# EAGLE design UCS (EAGLE 9.6.2)
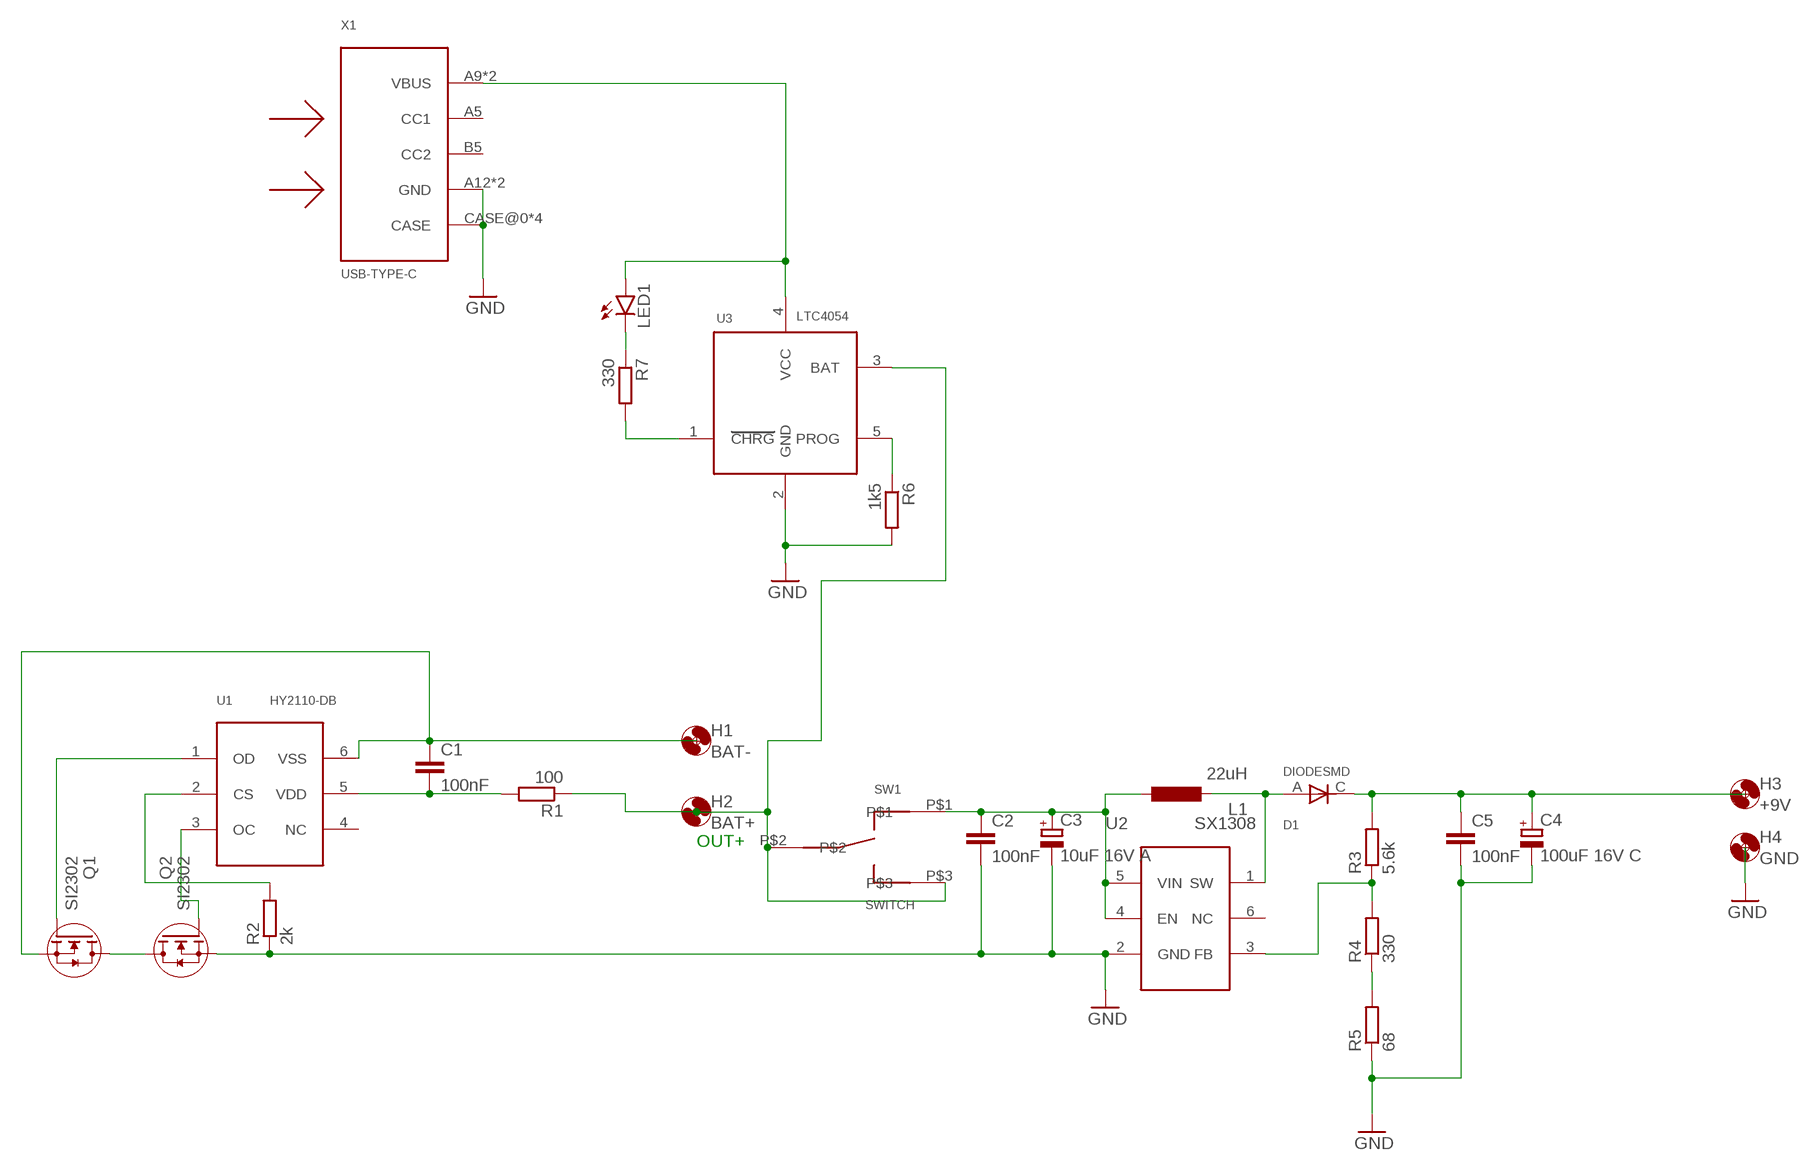
[diagram p0: schematic, sheet 1]

## Parts
C1  100nF  C-EUC0805  [C0805]
C2  100nF  C-EUC0805  [C0805]
C3  10uF 16V A  CPOL-EUSMCA  [SMC_A]
C4  100uF 16V C  CPOL-EUSMCC  [SMC_C]
C5  100nF  C-EUC0805  [C0805]
D1  DIODESMD  [DO214AC]
H1  BAT-  MOUNT-HOLE3.0  [3,0]
H2  BAT+  MOUNT-HOLE3.0  [3,0]
H3  +9V  MOUNT-HOLE3.0  [3,0]
H4  GND  MOUNT-HOLE3.0  [3,0]
L1  22uH  L-SMD-7*7*5  [L7*7*5]
LED1  LEDCHIPLED_0603  [CHIPLED_0603]
Q1  SI2302  [SOT-23-GSD]
Q2  SI2302  [SOT-23-GSD]
R1  100  R-EU_R0805  [R0805]
R2  2k  R-EU_R0805  [R0805]
R3  5.6k  R-EU_R0805  [R0805]
R4  330  R-EU_R0805  [R0805]
R5  68  R-EU_R0805  [R0805]
R6  1k5  R-EU_R0805  [R0805]
R7  330  R-EU_R0805  [R0805]
SW1  SWITCH  [SWITCH]
U1  HY2110-DB  [SOT-23-6]
U2  SX1308  [SOT-23-6]
U3  LTC4054  [SOT-23-5]
X1  USB-TYPE-C  [USB-TYPE-C]

## Nets
GND: C2.2 C3.- C4.- C5.2 H4.P$1 Q2.S R2.1 R5.1 R6.2 U2.2(GND) U3.2(GND) X1.A12(GND) X1.B12(GND) X1.CASE@0(CASE) X1.CASE@1(CASE) X1.CASE@2(CASE) X1.CASE@3(CASE)
N$1: H2.P$1 R1.1 SW1.P$2 SW1.P$3 U3.3(BAT)
N$2: C1.2 R1.2 U1.5(VDD)
N$3: C1.1 H1.P$1 Q1.S U1.6(VSS)
N$4: Q1.D Q2.D
N$5: D1.A(ANOD) L1.P$2 U2.1(SW)
N$6: Q1.G U1.1(OD)
N$7: Q2.G U1.3(OC)
N$8: R2.2 U1.2(CS)
N$9: C4.+ C5.1 D1.C(KATOD) H3.P$1 R3.2
N$10: R3.1 R4.2 U2.3(FB)
N$11: R4.1 R5.2
N$12: LED1.A U3.4(VCC) X1.A9(VBUS) X1.B9(VBUS)
N$13: LED1.C R7.1
N$14: R7.2 U3.1(CHRG)
N$15: R6.1 U3.5(PROG)
N$16: C2.1 C3.+ L1.P$1 SW1.P$1 U2.4(EN) U2.5(VIN)
Unconnected: U1.4(NC) U2.6(NC) X1.A5(CC1) X1.B5(CC2)

## Notes on the sheet
- OUT+

## Library data of the parts
C1 C2 C5 = rcl:C-EU: CAPACITOR, European symbol; SPICEPREFIX: C
C3 C4 = rcl:CPOL-EU: POLARIZED CAPACITOR, European symbol; SPICEPREFIX: C
D1 = usb:DIODE: DIODE
H1-H4 = usb:MOUNT-HOLE: MOUNTING HOLE with drill center marker
L1 = usb:L-SMD
LED1 = led:LED: LED OSRAM: - CHIPLED LG R971, LG N971, LY N971, LG Q971, LY Q971, LO R971, LY R971 LH N974, LH R974 LS Q976, LO Q976, LY Q976 LO Q996 - Hyper CHIPLED LW Q18S LB Q993, LB Q99A, LB R99A - SideLED LS A670, LO A670, LY A670, LG A670, LP A670 LB A673, LV A673, LT A673, LW A673 LH A674 LY A675 LS A676, LA A676, LO A676, LY A676, LW A676 LS A679, LY A679, LG A679 - Hyper Micro SIDELED® LS Y876, LA Y876, LO Y876, LY Y876 LT Y87S - SmartLED LW L88C, LW L88S LB L89C, LB L89S, LG L890 LS L89K, LO L89K, LY L89K LS L896, LA L896, LO L896, LY L896 - TOPLED LS T670, LO T670, LY T670, LG T670, LP T670 LSG T670, LSP T670, LSY T670, LOP T670, LYG T670 LG T671, LOG T671, LSG T671 LB T673, LV T673, LT T673, LW T673 LH T674 LS T676, LA T676, LO T676, LY T676, LB T676, LH T676, LSB T676, LW T676 LB T67C, LV T67C, LT T67C, LS T67K, LO T67K, LY T67K, LW E67C LS E67B, LA E67B, LO E67B, LY E67B, LB E67C, LV E67C, LT E67C LW T67C LS T679, LY T679, LG T679 LS T770, LO T770, LY T770, LG T770, LP T770 LB T773, LV T773, LT T773, LW T773 LH T774 LS E675, LA E675, LY E675, LS T675 LS T776, LA T776, LO T776, LY T776, LB T776 LHGB T686 LT T68C, LB T68C - Hyper Mini TOPLED® LB M676 - Mini TOPLED Santana® LG M470 LS M47K, LO M47K, LY M47K Source: http://www.osram.convergy.de LUXEON: - LUMILED® LXK2-PW12-R00, LXK2-PW12-S00, LXK2-PW14-U00, LXK2-PW14-V00 LXK2-PM12-R00, LXK2-PM12-S00, LXK2-PM14-U00 LXK2-PE12-Q00, LXK2-PE12-R00, LXK2-PE12-S00, LXK2-PE14-T00, LXK2-PE14-U00 LXK2-PB12-K00, LXK2-PB12-L00, LXK2-PB12-M00, LXK2-PB14-N00, LXK2-PB14-P00, LXK2-PB14-Q00 LXK2-PR12-L00, LXK2-PR12-M00, LXK2-PR14-Q00, LXK2-PR14-R00 LXK2-PD12-Q00, LXK2-PD12-R00, LXK2-PD12-S00 LXK2-PH12-R00, LXK2-PH12-S00 LXK2-PL12-P00, LXK2-PL12-Q00, LXK2-PL12-R00 Source: www.luxeon.com KINGBRIGHT: KA-3528ASYC Source: www.kingbright.com
Q1 Q2 = usb:SI2302: N-канальный полевик
R1-R7 = rcl:R-EU_: RESISTOR, European symbol; SPICEPREFIX: R
SW1 = usb:SWITCH
U1 = usb:HY2110-DB
U2 = usb:SX1308
U3 = usb:LTC4054
X1 = usb:USB-TYPE-C

## Board
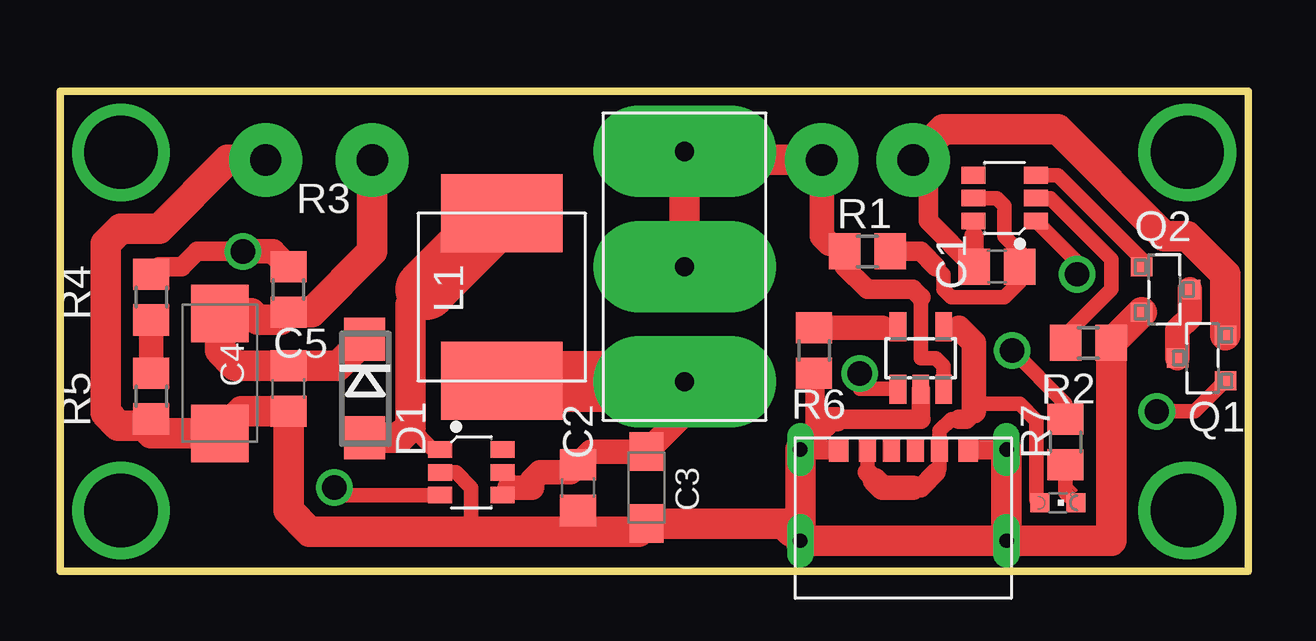
[diagram p1: board, top side]
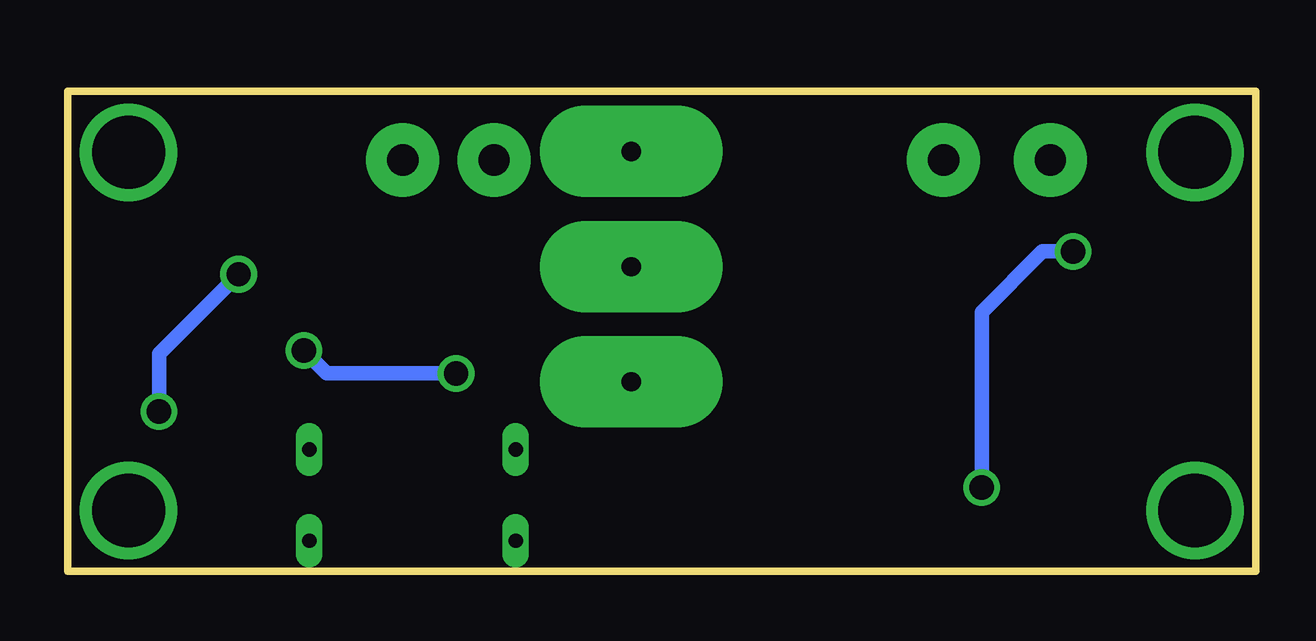
[diagram p2: board, bottom side, seen from below]

Size 49.53 x 20 mm. Coordinates in mm from the lower left corner, seen from the top.
Outline: 0,0 0,20 49.53,20 49.53,0 0,0
Copper layers (1*16): Top 0.035mm / dielectric 1.5mm / Bottom 0.035mm
Design rules "default": minimum track width 6mil, minimum drill 0.35mm, track to track 6mil, track to pad 6mil, pad to pad 6mil, via to via 6mil, smd to smd 6mil, copper to edge 40mil, drill to drill 6mil, minimum pad ring 10mil, minimum via ring 8mil, stop-mask expansion 4mil, vias tented up to drill 0mil, thermal gap 10mil

### Footprints (pad centres in the part's own frame; a part is rotated, then mirrored left to right if it is on the bottom)
C0805 = smd 1.3 x 1.5: 1 -0.95,0; 2 0.95,0
SMC_A = smd 1.6 x 1.4: + -1.5,0; - 1.5,0
SMC_C = smd 2.4 x 2.4: + -2.5,0; - 2.5,0
DO214AC = smd 1.8 x 1.7: A 2.05,0; C -2.05,0
3,0 = drill 1.3 pad 3.048: P$1 0,0
L7*7*5 = smd 3.251 x 5.08: P$1 -3.493,0; P$2 3.493,0
CHIPLED_0603 = smd 0.8 x 0.8: A 0,-0.75; C 0,0.75
SOT-23-GSD = smd 0.8 x 0.9: D 0,2; G -0.95,0; S 0.95,0
R0805 = smd 1.3 x 1.5: 1 -0.95,0; 2 0.95,0
SWITCH = drill 0.8 pad 3.81 long: P$1 -4.8,0; P$2 0,0; P$3 4.8,0
SOT-23-6 = smd 0.69 x 1: 1 -0.95,-1.3; 2 0,-1.3; 3 0.95,-1.3; 4 0.95,1.3; 5 0,1.3; 6 -0.95,1.3
SOT-23-5 = smd 0.69 x 1.2: 1 -0.95,-1.3; 2 0,-1.3; 3 0.95,-1.3; 4 0.95,1.3; 5 -0.95,1.3
USB-TYPE-C = smd 0.7 x 1: A5 1,0; A9 3,0; B5 2,0; B9 0,0 | smd 0.8 x 1: A12 4.2,0; B12 -1.2,0 | drill 0.6 pad 1.016 long: CASE@0 -2.8,0; CASE@1 -2.8,-3.8; CASE@2 5.8,-3.8; CASE@3 5.8,0

### Placement (x,y rotation side)
C1  39.05,12.7 0 top
C2  21.59,3.49 270 top
C3  24.45,3.49 270 top
C4  6.67,8.26 270 top
C5  9.53,7.62 270 top
D1  12.7,7.62 270 top
H1  35.56,17.14 180 top
H2  31.75,17.14 180 top
H3  13.02,17.14 180 top
H4  8.57,17.14 180 top
L1  18.41,11.43 90 top
LED1  41.59,2.86 270 top
Q1  48.58,8.89 90 top
Q2  45.09,11.75 270 top
R1  33.66,13.34 0 top
R2  42.86,9.53 180 top
R3  9.53,11.75 270 top
R4  3.81,11.43 90 top
R5  3.81,7.3 90 top
R6  31.43,9.21 270 top
R7  41.91,5.4 90 top
SW1  26.04,12.7 90 bottom
U1  39.37,15.56 90 top
U2  17.14,4.13 270 top
U3  35.88,8.89 0 top
X1  33.66,5.08 0 top

### Tracks (layer width: path | path; a pad name or v marks a point on that pad's centre or on a via)
GND
  Top 0.152: 32.45,5.15 X1.B12 | R6.2 31.43,7.94 | 44.13,9.21 R2.1
  Top 0.61: C2.2 21.59,1.65 | U2.2 16.51,4.13 17.14,3.49 17.14,1.97 16.83,1.65 | R5.1 3.81,6.07 3.81,5.75
  Top 0.762: U3.2 35.88,6.35
  Top 0.813: X1.B12 X1.CASE@0 | X1.A12 X1.CASE@3 | 35.88,6.35 32.38,6.35 | R6.2 31.46,8.23 31.46,5.69
  Top 1.016: 32.38,6.35 32.12,6.35 31.46,5.69 X1.CASE@0
  Top 1.27: X1.CASE@2 X1.CASE@3 | 30.86,1.65 X1.CASE@1 X1.CASE@2 | 30.86,1.65 X1.CASE@0 | X1.CASE@2 39.47,1.27 43.81,1.27 R2.1 Q2.S | 6.35,5.44 C4.- | C4.- 7.26,6.35 | C4.- 3.81,5.75 | 3.81,6.07 2.44,6.07 1.91,6.6 1.91,13.65 2.54,14.29 4.13,14.29 6.99,17.14 H4.P$1 | 30.86,1.65 30.48,1.65 30.14,1.99 C3.- 24.11,1.65 21.59,1.65 16.83,1.65 10.41,1.65 9.53,2.54 C5.2 7.58,6.67 C4.-
N$1
  Top 0.152: 33.02,13.34 R1.1
  Top 0.61: U3.3 36.83,8.57 36.51,8.89 35.88,8.89 35.88,11.43
  Top 0.813: 35.88,11.43 35.56,11.75 33.66,11.75 32.7,12.7 R1.1 32.38,13.34 32.07,13.65
  Top 1.016: 32.07,13.65 31.75,13.97 H2.P$1
  Top 1.27: H2.P$1 26.39,17.14 SW1.P$3 SW1.P$2
N$2
  Top 0.152: C1.2
  Top 0.61: 36.51,12.7 36.83,12.38 36.83,11.75 37.15,11.43 39.37,11.43 40.01,12.06 C1.2 40.01,13.34 39.37,13.97 39.37,15.24 39.05,15.56 U1.5
  Top 0.813: R1.2 35.88,13.34 36.51,12.7
N$3
  Top 0.152: C1.1 38.07,12.73
  Top 0.61: U1.6 38.07,14 38.1,13.97
  Top 0.813: H1.P$1 36.2,16.51 36.2,14.61 C1.1 | C1.1 | 38.1,13.97 C1.1
  Top 1.27: Q1.S 48.58,12.38 46.99,13.97 46.04,13.97 41.59,18.41 36.83,18.41 H1.P$1
N$4
  Top 1.016: Q1.D 46.58,10.06 47.09,10.57 Q2.D
N$5
  Top 0.61: U2.1 15.56,5.08 14.61,6.03
  Top 1.27: D1.A 14.14,5.57 14.61,6.03 14.61,11.11 15.24,11.75
  Top 2.54: L1.P$2 15.24,11.75
N$6  (via drill 1.02)
  Top 0.61: U1.1 42.4,12.88 v42.4,12.38 | Q1.G 47.3,6.67 v45.72,6.67
  Bottom 0.61: v45.72,6.67 45.72,9.06 v42.4,12.38
N$7
  Top 0.61: U1.3 41.59,16.51 45.09,13.02 Q2.G
N$8
  Top 0.61: U1.2 41.27,15.56 43.81,13.02 43.81,11.75 41.91,9.85 R2.2
N$9
  Top 0.152: C5.1 9.17,8.57 | 9.25,11.07 R3.2 9.85,10.8
  Top 1.27: H3.P$1 13.02,13.34 10.48,10.8 R3.2 9.21,10.48 8.26,10.48 7.98,10.76 C4.+ 6.67,9.21 7.3,8.57 C5.1 11.6,8.57 D1.C
N$10  (via drill 1.02)
  Top 0.61: U2.3 11.74,3.18 v11.43,3.49
  Top 0.813: R4.2 4.13,12.7 5.08,12.7 5.71,13.34 v7.62,13.34
  Top 1.016: R3.1 8.89,13.33 8.89,13.34 v7.62,13.34
  Bottom 0.61: v7.62,13.34 8.89,13.34 11.43,10.79 v11.43,3.49
N$11
  Top 1.016: R5.2 R4.1
N$12
  Top 0.152: 36.66,5.22 X1.A9 | 40.64,3.06 LED1.A
  Top 0.61: 36.51,4.13 36.66,4.27 X1.A9 36.66,5.86 37.15,6.35 37.47,6.35 | X1.B9 33.66,4.13 | U3.4 37.44,10.19 37.47,10.16 | LED1.A 40.82,2.86 40.7,2.97 40.7,6.29 40.01,6.99 38.42,6.99 38.1,6.67
  Top 0.813: 33.66,4.13 33.97,3.81 | 35.56,3.49 35.88,3.49 36.51,4.13 | 38.1,6.67 37.78,6.35 37.47,6.35
  Top 1.016: 33.97,3.81 34.29,3.49 35.56,3.49 | 37.47,10.16 38.1,9.53 38.1,6.67
N$13
  Top 0.152: 42.34,3.38 41.91,3.81 | R7.1
  Top 0.61: LED1.C 41.91,3.29 41.91,3.81 R7.1
N$14  (via drill 1.02)
  Top 0.61: U3.1 34.9,7.62 33.34,7.62 v33.34,8.26 | R7.2 41.91,6.99 v39.69,9.21
  Bottom 0.61: v33.34,8.26 38.73,8.26 v39.69,9.21
N$15
  Top 0.152: R6.1 31.46,10.19
  Top 0.61: U3.5 34.9,10.16 34.29,10.16
  Top 1.016: 34.29,10.16 R6.1
N$16
  Top 0.152: 21.27,4.44 C2.1
  Top 0.61: U2.4 18.45,3.21 18.73,3.49 18.73,3.84 U2.5
  Top 1.016: SW1.P$1 26.04,6.58 C3.+ 22.14,4.99 C2.1 21.27,4.13 20,4.13 19.68,3.81 19.68,3.49 18.73,3.49
  Top 2.54: SW1.P$1 18.45,7.9 L1.P$1
N$17  (via drill 3.05)
  other vias: 2.54,17.46
N$18  (via drill 3.05)
  other vias: 2.54,2.54
N$19  (via drill 3.05)
  other vias: 46.99,2.54
N$20  (via drill 3.05)
  other vias: 46.99,17.46